# Altium schematic sheet Buzzer Setup.SchDoc: Speaker Driver
size A3; DrawnBy: Harry Dobbs; Address1: ECE Department; Address2: University of Canterbury; Address3: Christchurch 8041; Address4: New Zealand; Revision: 1
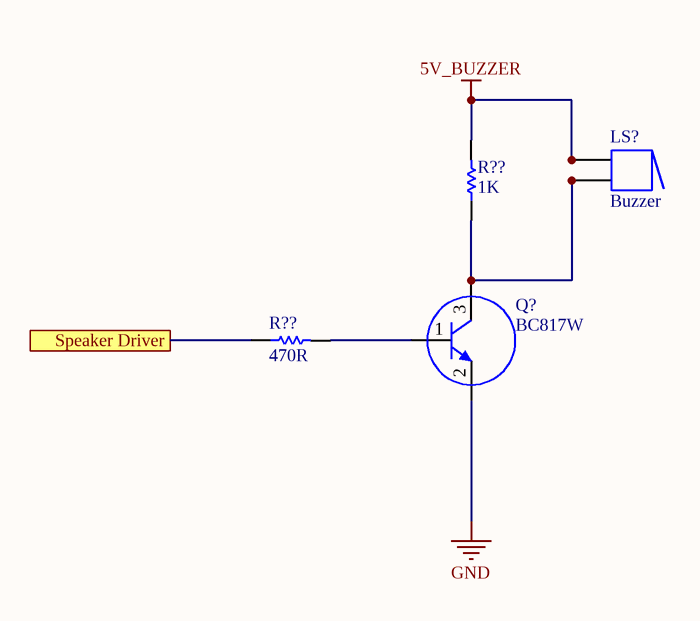
[diagram p0: Buzzer Setup.SchDoc]

## Parts
(Parts that share a designator on the sheet are numbered #1, #2 ... from top to bottom, then left to right.)
LS?  Buzzer  [ABSM-1574]
Q?  BC817W  [SOT323_M]
R??#1  1K  [RESC1608L]
R??#2  470R  [RESC1608L]

## Ports
Speaker Driver

## Nets
5V_BUZZER: LS?.1 LS?.1A R??#1.2
GND: Q?.2
Speaker Driver: R??#2.1 ; port Speaker Driver
NetLS?_2: LS?.2 LS?.2A Q?.3 R??#1.1
NetQ?_1: Q?.1 R??#2.2

## Notes on the sheet
- Title
- Drawn by:
- Date:
- Time:
- Revision:
- Sheet
- of
- File:

## Library data of the parts
LS? = Buzzer: Magnetic Transducer Buzzer; Published: 24-Mar-1999; LatestRevisionDate: 17-Dec-2003; LatestRevisionNote: Schematic revised, PCB Footprint replaced.; DatasheetVersion: 17-Dec-2003; PackageReference: ABSM-1574; Publisher: Altium Limited; PackageDescription: Magnetic Transducer Buzzer; ComponentLink1Description: Manufacturer Link; ComponentLink1URL: http://www.megastar.com/linecard/buzzmode/index.php
Q? = TB_BC817W: NPN GP Bipolar Transistor 45V 500mA SOT323; Manufacturer: NXP; Supplier 1: Farnell; Supplier Part Number 1: 2114873; Manufacturer PN: BC817W; Storage Location: PCB Assembly WS; Supplier: ECE Dept; Value: BC817W
R??#1 = RS_1K: RES 1.0K OHM 1/10W 5% 0603 SMD; Storage Location: PCB Assembly WS; Supplier: ECE Dept; Value: 1K
R??#2 = RS_470R: RES 470 OHM 1/10W 5% 0603 SMD; Storage Location: PCB Assembly WS; Supplier: ECE Dept; Value: 470R